# EAGLE design lab1-schematic (EAGLE 9.5.2)
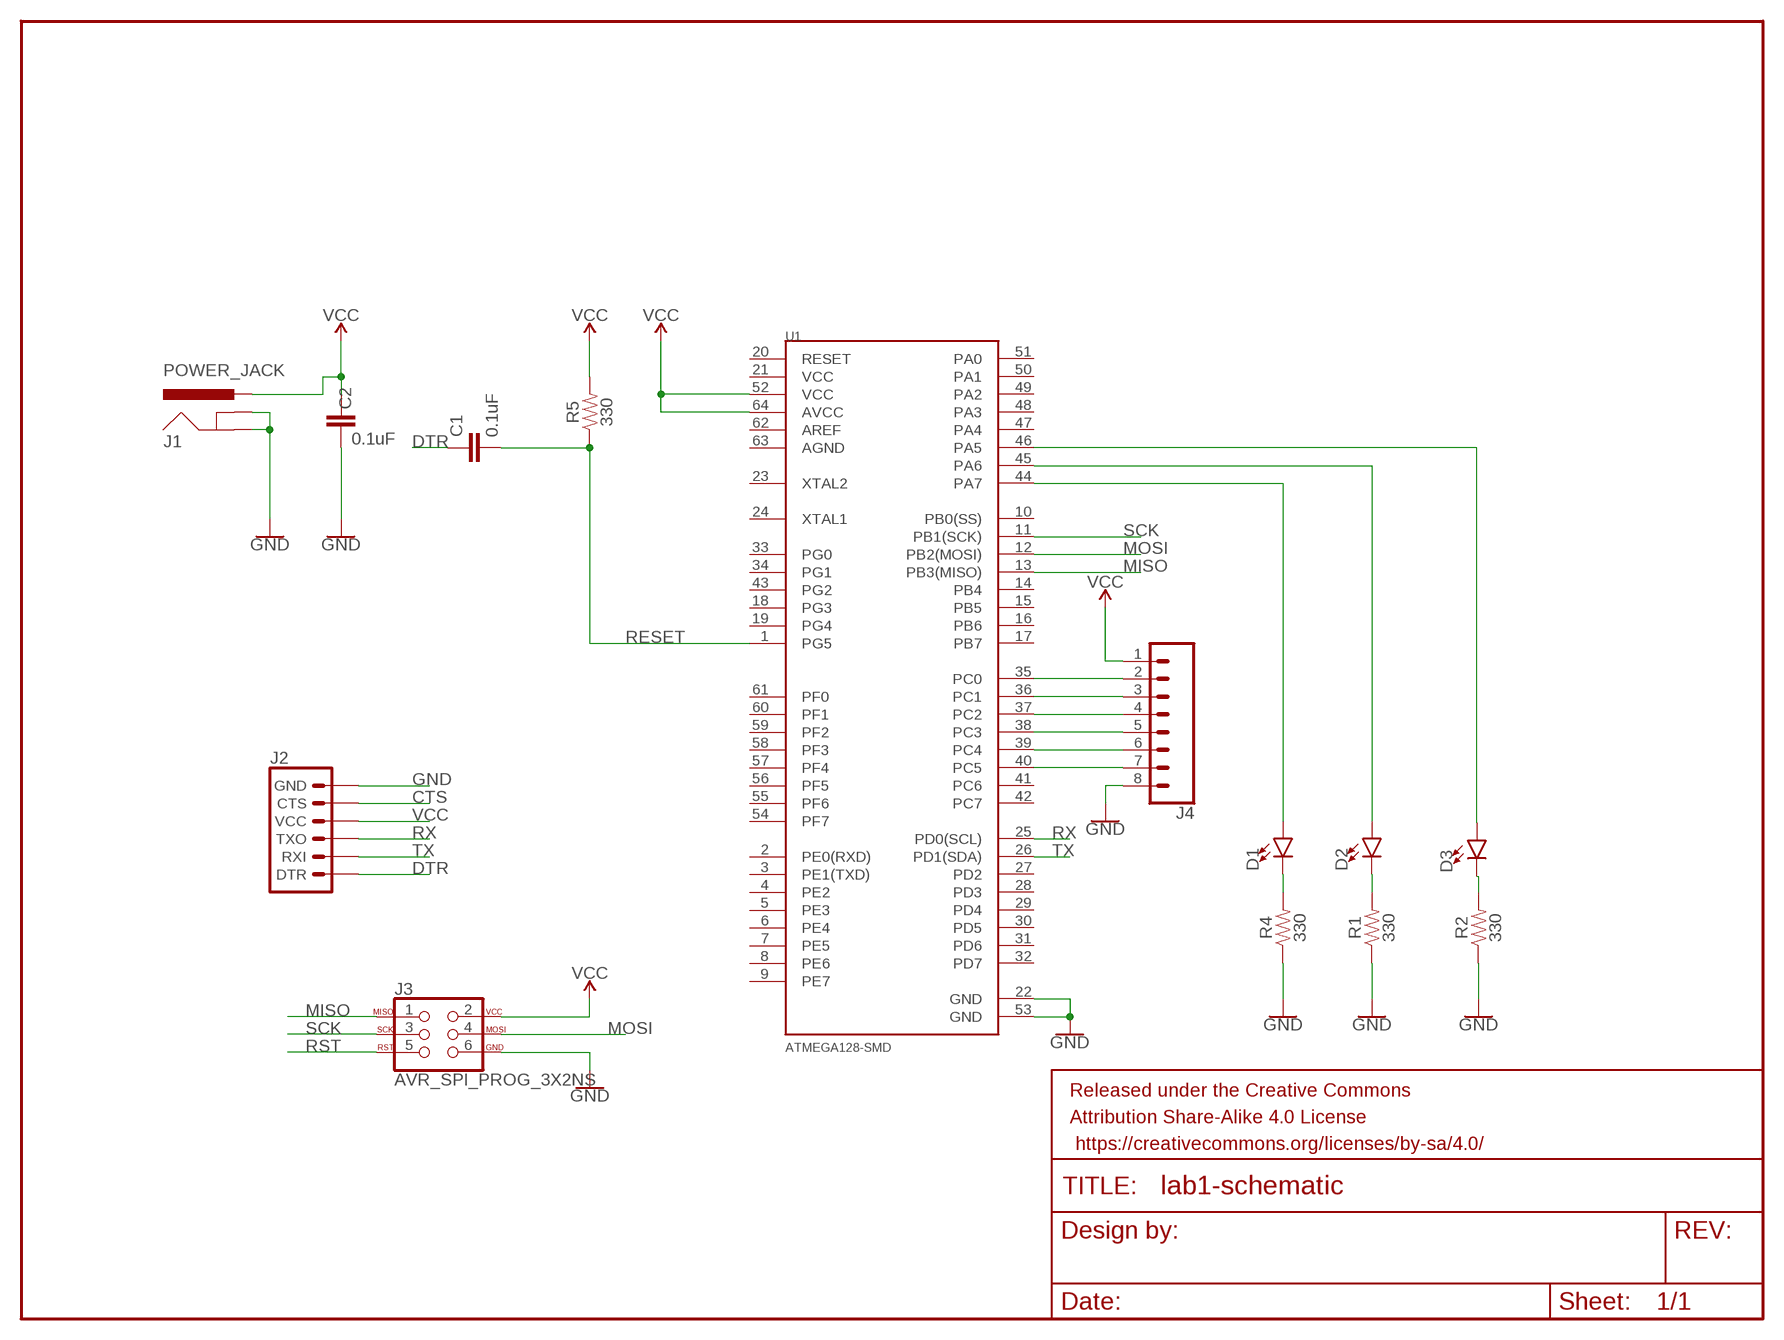
[diagram p0: schematic, sheet 1]

## Parts
C1  0.1uF  0.1UF-KIT-EZ-50V-20%  [CAP-PTH-SMALL-KIT]
C2  0.1uF  0.1UF-KIT-EZ-50V-20%  [CAP-PTH-SMALL-KIT]
D1  LED3MM  [LED_3MM]
D2  LED3MM  [LED_3MM]
D3  LED3MM  [LED_3MM]
FRAME1  FRAME-LETTER  [CREATIVE_COMMONS]
J1  POWER_JACK  [POWER_JACK_PTH]
J2  6_PIN_SERIAL_TARGET  [1X06]
J3  AVR_SPI_PROG_3X2NS  [2X3-NS]
J4  CONN_08"  [1X08]
R1  330  330OHM-HORIZ-1/10W-5%  [AXIAL-0.3]
R2  330  330OHM-HORIZ-1/10W-5%  [AXIAL-0.3]
R4  330  330OHM-HORIZ-1/10W-5%  [AXIAL-0.3]
R5  330  330OHM-HORIZ-1/10W-5%  [AXIAL-0.3]
U1  ATMEGA128-SMD  [TQFP64_14X14MM]

## Nets
CTS: J2.5(CTS)
DTR: C1.1 J2.1(DTR)
GND: C2.2 J1.GND J1.GNDBREAK J2.6(GND) J3.6 J4.8 R1.P$1 R2.P$1 R4.P$1 U1.22(GND) U1.53(GND)
MISO: J3.1 U1.13(PB3(MISO))
MOSI: J3.4 U1.12(PB2(MOSI))
N$2: J4.2 U1.35(PC0)
N$3: J4.3 U1.36(PC1)
N$4: J4.4 U1.37(PC2)
N$5: J4.5 U1.38(PC3)
N$6: J4.6 U1.39(PC4)
N$7: J4.7 U1.40(PC5)
N$8: D2.A U1.45(PA6)
N$9: D3.A U1.46(PA5)
N$10: D1.A U1.44(PA7)
N$11: D1.K(C) R4.P$2
N$12: D2.K(C) R1.P$2
N$13: D3.K(C) R2.P$2
RESET: C1.2 R5.P$1 U1.1(PG5)
RST: J3.5
RX: J2.3(TXO) U1.25(PD0(SCL))
SCK: J3.3 U1.11(PB1(SCK))
TX: J2.2(RXI) U1.26(PD1(SDA))
VCC: C2.1 J1.PWR J2.4(VCC) J3.2 J4.1 R5.P$2 U1.52(VCC) U1.64(AVCC)
Unconnected: U1.2(PE0(RXD)) U1.3(PE1(TXD)) U1.4(PE2) U1.5(PE3) U1.6(PE4) U1.7(PE5) U1.8(PE6) U1.9(PE7) U1.10(PB0(SS)) U1.14(PB4) U1.15(PB5) U1.16(PB6) U1.17(PB7) U1.18(PG3) U1.19(PG4) U1.20(RESET) U1.21(VCC) U1.23(XTAL2) U1.24(XTAL1) U1.27(PD2) U1.28(PD3) U1.29(PD4) U1.30(PD5) U1.31(PD6) U1.32(PD7) U1.33(PG0) U1.34(PG1) U1.41(PC6) U1.42(PC7) U1.43(PG2) U1.47(PA4) U1.48(PA3) U1.49(PA2) U1.50(PA1) U1.51(PA0) U1.54(PF7) U1.55(PF6) U1.56(PF5) U1.57(PF4) U1.58(PF3) U1.59(PF2) U1.60(PF1) U1.61(PF0) U1.62(AREF) U1.63(AGND)

## Library data of the parts
C1 C2 = SparkFun-Capacitors:0.1UF: 0.1µF ceramic capacitors A capacitor is a passive two-terminal electrical component used to store electrical energy temporarily in an electric field.; PROD_ID: CAP-08370
D1-D3 = SparkFun-LED:LED: LED (Generic) Standard schematic elements and footprints for 5mm, 3mm, 1206, and 0603 sized LEDs. Generic LEDs with no color specified.; PROD_ID: DIO-08794
FRAME1 = SparkFun-Aesthetics:FRAME-LETTER: Schematic Frame - Letter Standard 8.5x11 US Letter frame
J1 = SparkFun-Connectors:POWER_JACK: Power Jack Connector This is the standard 5.5mm barrel jack for power. The PTH is the most common, proven, reliable, footprint. The Slot footprint only works if the mill layer is transmitted to the PCB fab house so be warned. Here are the connectors we sell at SparkFun: DC Barrel Power Jack/Connector <https://www.sparkfun.com/products/119> (PRT-00119) DC Barrel Power Jack/Connector (SMD) <https://www.sparkfun.com/products/12748> (PRT-12748) DC Barrel Jack Adapter - Breadboard Compatible <https://www.sparkfun.com/products/10811> (PRT-10811) It is used on this SparkFun product (and many, many others): SparkFun RedBoard - Programmed with Arduino <https://www.sparkfun.com/products/12757> (DEV-12757) Also, if you need a mating power supply or connector, please check these out: Wall Adapter Power Supply - 9VDC 650mA <https://www.sparkfun.com/products/298> (TOL-00298) DC Barrel Jack Adapter - Male <https://www.sparkfun.com/products/10287> (PRT-10287); PROD_ID: CONN-08197
J2 = SparkFun-Connectors:6_PIN_SERIAL_TARGET: 6-pin header connection for use with the "FTDI BASIC" pinout - TARGET SIDE. Also known as "Arduino Serial Program Header". It is used to mate with our FTDI Basic serial programmers using the Arduino IDE. Note, this device has "TARGET" in the name. It is intended to be used on a design that contains a target micro-controller that you wish to program. The "sister" device, named "CABLE" is inteneded to be used on a design that usually lives on the end of your USB cable and prvides the converter chip (FTDI232 or FTDI231x) to commnicate serial RX/TX. You can populate with some of these: Break Away Headers - Straight <https://www.sparkfun.com/products/116> (PRT-00116) For reference (or to suit your programming needs) check out these designs: SparkFun FTDI Basic Breakout - 5V <https://www.sparkfun.com/products/9716> (DEV-09716) SparkFun FTDI Basic Breakout - 3.3V <https://www.sparkfun.com/products/9873> (DEV-09873) SparkFun FTDI SmartBasic <https://www.sparkfun.com/products/12935> (DEV-12935) SparkFun Beefy 3 - FTDI Basic Breakout <https://www.sparkfun.com/products/13746> (DEV-13746)
J3 = SparkFun-Connectors:AVR_SPI_PROG_3X2: AVR ISP 6 Pin This is the reduced ISP connector for AVR programming. Common on Arduino. This footprint will take up less PCB space and can be used with a 10-pin to 6-pin adapter such as SKU: BOB-08508 **Special note about "TEST_POINT" package. The stop mask is on the top side, so if you want your programming test points to be on the bottom of your board, make sure to place this package on the bottom side of the board. This also ensure that the orientation to program from the bottom side will be correct. SparkFun Products: SparkFun ISP Pogo Adapter <https://www.sparkfun.com/products/11591> - NS Tiny AVR Programmer <https://www.sparkfun.com/products/11801> -PTH
J4 = SparkFun-Connectors:CONN_08: Multi connection point. Often used as Generic Header-pin footprint for 0.1 inch spaced/style header connections On any of the 0.1 inch spaced packages, you can populate with these: Break Away Headers - Straight <https://www.sparkfun.com/products/116> (PRT-00116) Break Away Male Headers - Right Angle <https://www.sparkfun.com/products/553> (PRT-00553) Female Headers <https://www.sparkfun.com/products/115> (PRT-00115) Break Away Headers - Machine Pin <https://www.sparkfun.com/products/117> (PRT-00117) Break Away Female Headers - Swiss Machine Pin <https://www.sparkfun.com/products/743> (PRT-00743) Arduino Stackable Header - 8 Pin <https://www.sparkfun.com/products/9279> (PRT-09279) For SCREWTERMINALS and SPRING TERMINALS visit here: Screw Terimnals on SparkFun.com <https://www.sparkfun.com/search/results?term=Screw+Terminals> (5mm/3.5mm/2.54mm spacing) This device is also useful as a general connection point to wire up your design to another part of your project. Our various solder wires solder well into these plated through hole pads. Hook-Up Wire - Assortment (Stranded, 22 AWG) <https://www.sparkfun.com/products/11375> (PRT-11375) Hook-Up Wire - Assortment (Solid Core, 22 AWG) <https://www.sparkfun.com/products/11367> (PRT-11367) View the entire wire category on our website here <https://www.sparkfun.com/categories/141> Special notes: Molex polarized connector foot print use with SKU : PRT-08231 with associated crimp pins and housings. 1MM SMD Version SKU: PRT-10208 NOTES ON THE VARIANTS LOCK and LOCK_LONGPADS... This footprint was designed to help hold the alignment of a through-hole component (i.e. 6-pin header) while soldering it into place. You may notice that each hole has been shifted either up or down by 0.005 of an inch from it's more standard position (which is a perfectly straight line). This slight alteration caused the pins (the squares in the middle) to touch the edges of the holes. Because they are alternating, it causes a "brace" to hold the component in place. 0.005 has proven to be the perfect amount of "off-center" position when using our standard breakaway headers. Although looks a little odd when you look at the bare footprint, once you have a header in there, the alteration is very hard to notice. Also,if you push a header all the way into place, it is covered up entirely on the bottom side.; PROD_ID: CONN-08438
R1 R2 R4 R5 = SparkFun-Resistors:330OHM: 330Ω resistor A resistor is a passive two-terminal electrical component that implements electrical resistance as a circuit element. Resistors act to reduce current flow, and, at the same time, act to lower voltage levels within circuits. - Wikipedia; PROD_ID: RES-8371
U1 = SparkFun-IC-Microcontroller:ATMEGA128: ATmega 128 ATmega128/128L/1281/2561. Note: The ATmega128 pin 1 is PEN and the ATmega256/1281 pin 1 is PG5. Not in catalog

## Board
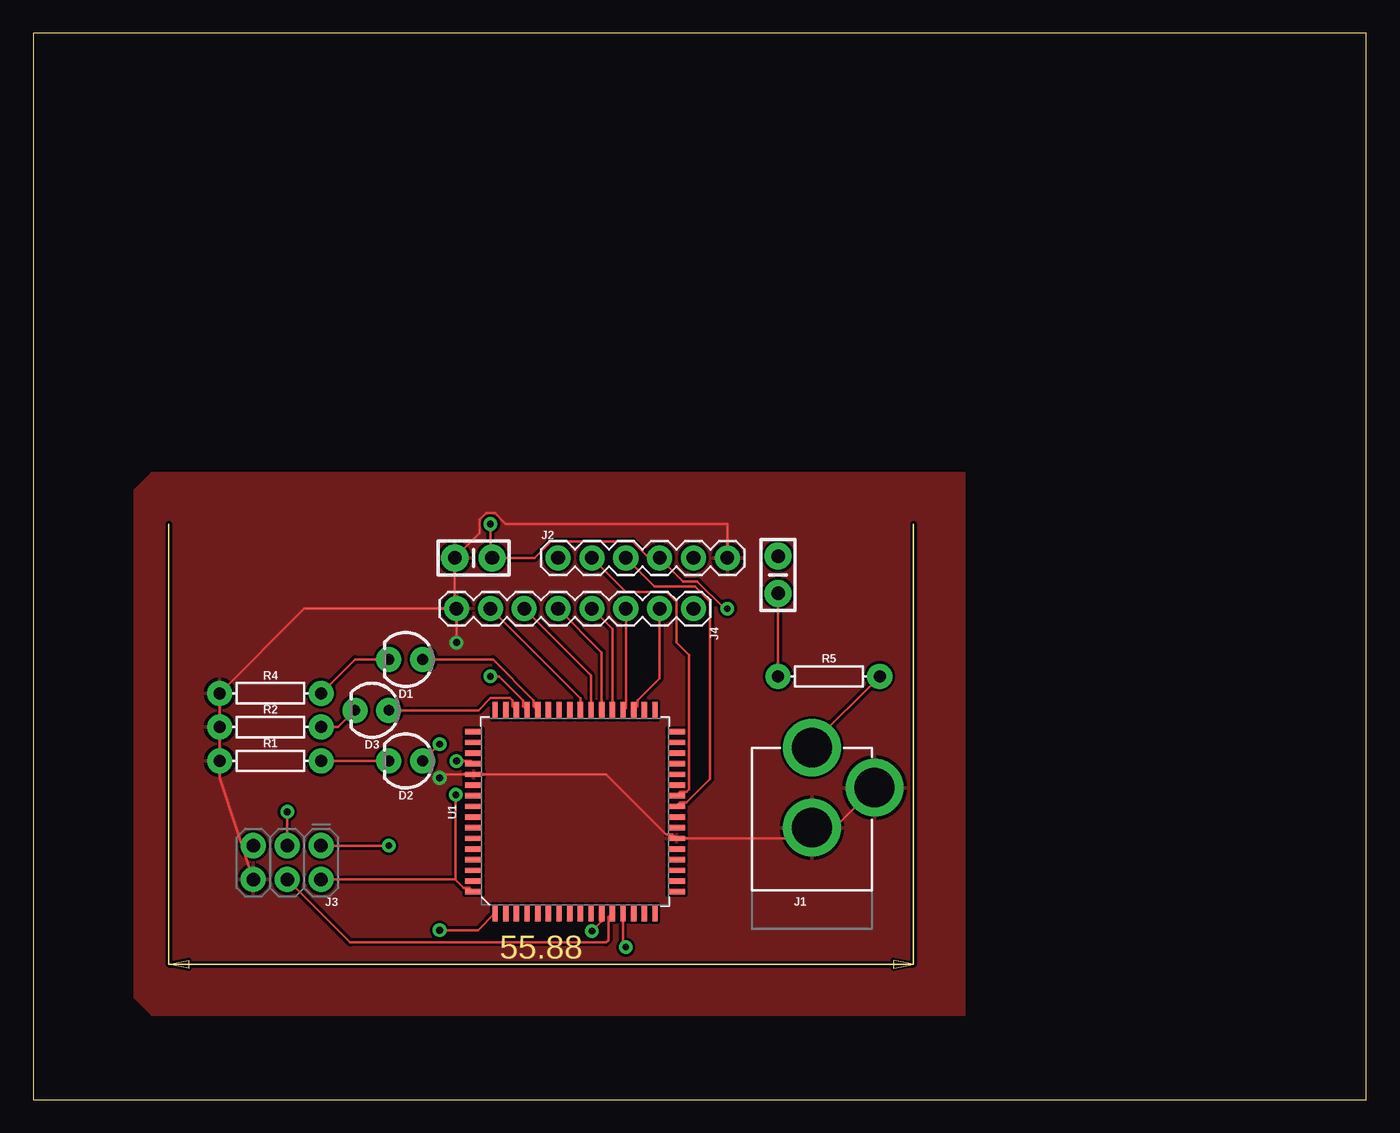
[diagram p1: board, top side]
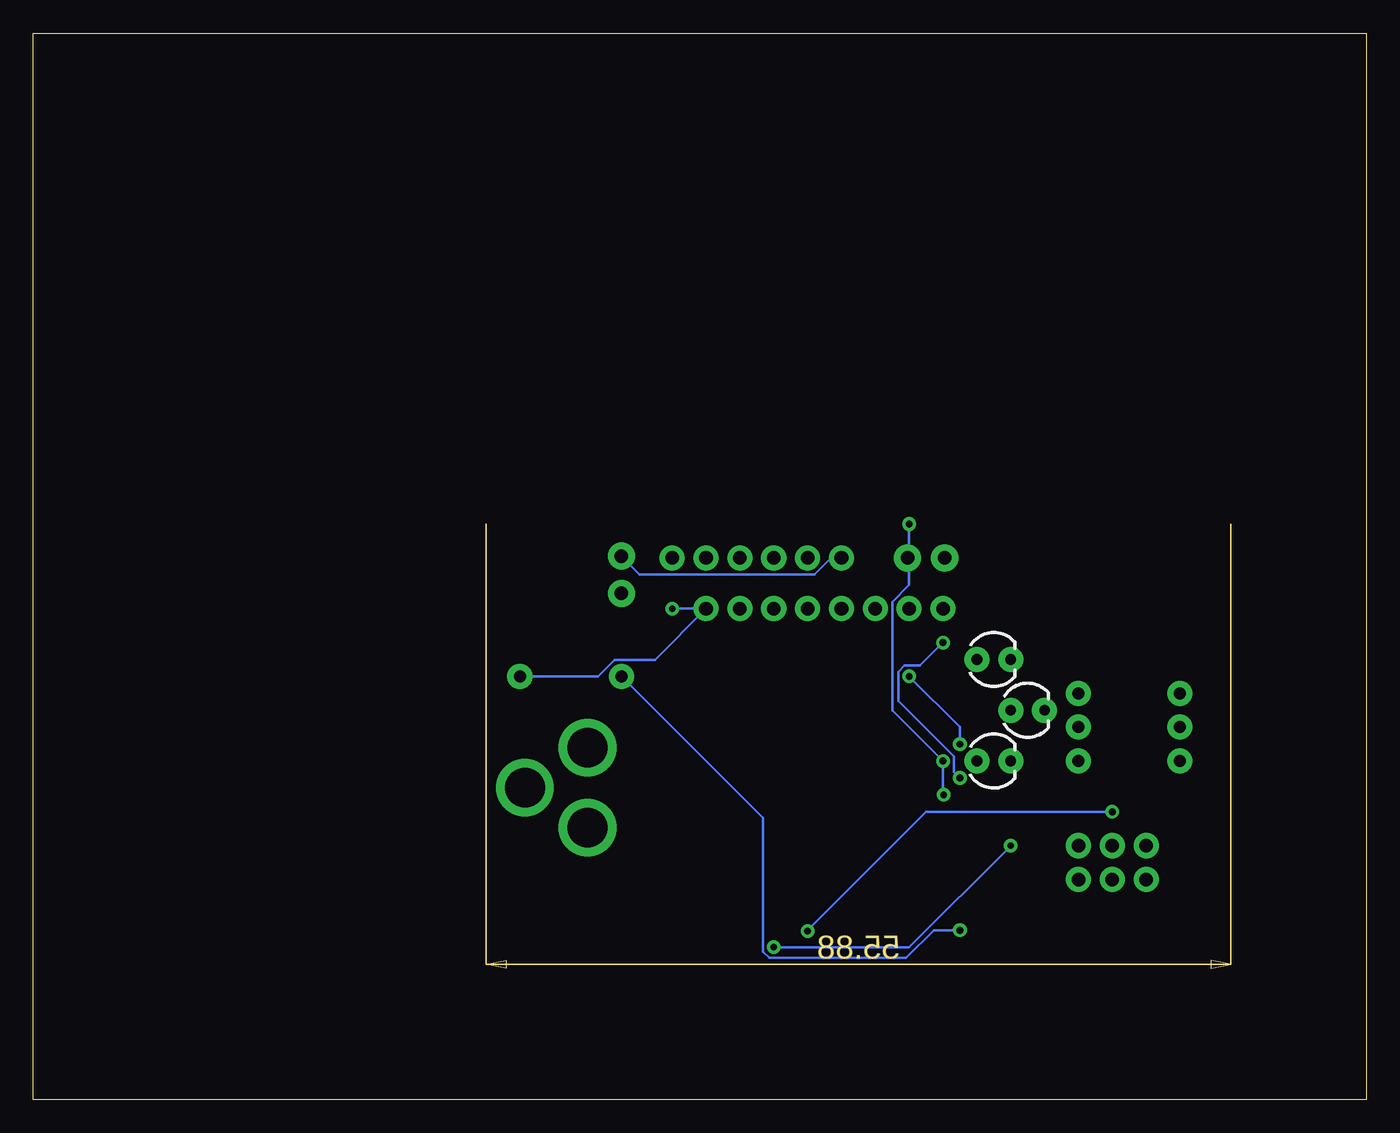
[diagram p2: board, bottom side, seen from below]

Size 100 x 80 mm. Coordinates in mm from the lower left corner, seen from the top.
Outline: 0,0 100,0 100,80 0,80 0,0
Copper layers (1*16): Top 0.035mm / dielectric 1.5mm / Bottom 0.035mm
Design rules "SparkFun": minimum track width 8mil, minimum drill 20mil, track to track 8mil, track to pad 8mil, pad to pad 8mil, via to via 8mil, smd to smd 8mil, copper to edge 8mil, drill to drill 8mil, minimum pad ring 12mil, minimum via ring 10mil, stop-mask expansion 4mil, vias tented up to drill 20mil, thermal gap 10mil

### Footprints (pad centres in the part's own frame; a part is rotated, then mirrored left to right if it is on the bottom)
CAP-PTH-SMALL-KIT = drill 1.016 pad 2.032: 1 -1.397,0; 2 1.397,0
LED_3MM = drill 0.813 pad 1.88: A -1.27,0; K 1.27,0
POWER_JACK_PTH = drill 2.997 pad 4.318: GND 0,7.7; GNDBREAK 4.7,10.7; PWR 0,13.7
1X06 = drill 1.016 pad 1.88: 1 0,0; 2 2.54,0; 3 5.08,0; 4 7.62,0; 5 10.16,0; 6 12.7,0
2X3-NS = drill 1.016 pad 1.88: 1 -2.54,-1.27; 2 -2.54,1.27; 3 0,-1.27; 4 0,1.27; 5 2.54,-1.27; 6 2.54,1.27
1X08 = drill 1.016 pad 1.88: 1 0,0; 2 2.54,0; 3 5.08,0; 4 7.62,0; 5 10.16,0; 6 12.7,0; 7 15.24,0; 8 17.78,0
AXIAL-0.3 = drill 0.9 pad 1.88: P$1 -3.81,0; P$2 3.81,0
TQFP64_14X14MM = smd 0.4 x 1.27: 1 -6,-7.6; 2 -5.2,-7.6; 3 -4.4,-7.6; 4 -3.6,-7.6; 5 -2.8,-7.6; 6 -2,-7.6; 7 -1.2,-7.6; 8 -0.4,-7.6; 9 0.4,-7.6; 10 1.2,-7.6; 11 2,-7.6; 12 2.8,-7.6; 13 3.6,-7.6; 14 4.4,-7.6; 15 5.2,-7.6; 16 6,-7.6; 33 6,7.6; 34 5.2,7.6; 35 4.4,7.6; 36 3.6,7.6; 37 2.8,7.6; 38 2,7.6; 39 1.2,7.6; 40 0.4,7.6; 41 -0.4,7.6; 42 -1.2,7.6; 43 -2,7.6; 44 -2.8,7.6; 45 -3.6,7.6; 46 -4.4,7.6; 47 -5.2,7.6; 48 -6,7.6 | smd 1.27 x 0.4: 17 7.6,-6; 18 7.6,-5.2; 19 7.6,-4.4; 20 7.6,-3.6; 21 7.6,-2.8; 22 7.6,-2; 23 7.6,-1.2; 24 7.6,-0.4; 25 7.6,0.4; 26 7.6,1.2; 27 7.6,2; 28 7.6,2.8; 29 7.6,3.6; 30 7.6,4.4; 31 7.6,5.2; 32 7.6,6; 49 -7.6,6; 50 -7.6,5.2; 51 -7.6,4.4; 52 -7.6,3.6; 53 -7.6,2.8; 54 -7.6,2; 55 -7.6,1.2; 56 -7.6,0.4; 57 -7.6,-0.4; 58 -7.6,-1.2; 59 -7.6,-2; 60 -7.6,-2.8; 61 -7.6,-3.6; 62 -7.6,-4.4; 63 -7.6,-5.2; 64 -7.6,-6

### Placement (x,y rotation side)
C1  55.88,39.37 270 top
C2  33.02,40.64 180 top
D1  27.94,33.02 180 top
D2  27.94,25.4 180 top
D3  25.4,29.21 180 top
FRAME1  -80.01,19.05 0 top  (outside the outline)
J1  58.42,12.7 0 top
J2  39.37,40.64 0 top
J3  19.05,17.78 180 top
J4  49.53,36.83 180 top
R1  17.78,25.4 0 top
R2  17.78,27.94 0 top
R4  17.78,30.48 0 top
R5  59.69,31.75 0 top
U1  40.64,21.59 0 top

### Tracks (layer width: path | path; a pad name or v marks a point on that pad's centre or on a via)
DTR
  Bottom 0.203: J2.1 40.15,40.64 41.39,39.4 54.51,39.4 C1.1
GND  (via drill 0.51)
  Top 0.203: J3.6 13.97,24.13 R1.P$1 R2.P$1 R4.P$1 20.32,36.83 J4.8 | J4.8 31.62,36.96 C2.2 33.48,42.49 33.48,43.52 33.95,43.99 34.63,43.99 35.44,43.18 52.07,43.18 J2.6 | U1.22 48.26,19.59 | 48.26,19.59 57.61,19.59 J1.GND 60.12,20.4 J1.GNDBREAK | J4.8 v31.75,34.29 | v30.48,24.13 30.74,24.39 U1.53 42.97,24.39 47.48,19.89 47.97,19.89 48.26,19.59
  Bottom 0.203: v30.48,24.13 30.94,24.59 30.94,25.74 35.1,29.9 35.1,32.09 34.63,32.56 33.48,32.56 v31.75,34.29
  pour Top (isolate 0): 8.89,46.99 69.85,46.99 69.85,6.35 8.89,6.35 7.62,7.62 7.62,45.72
MISO  (via drill 0.51)
  Top 0.203: J3.1 v26.67,19.05 | v44.45,11.43 44.24,11.64 U1.13
  Bottom 0.203: v26.67,19.05 34.29,11.43 v44.45,11.43
MOSI
  Top 0.203: U1.12 43.15,13.7 43.15,11.96 42.97,11.78 23.78,11.78 J3.4
N$2
  Top 0.203: U1.35 45.34,29.48 45.34,29.95 46.99,31.61 J4.2
N$3
  Top 0.203: J4.3 44.45,29.4 U1.36
N$4
  Top 0.203: J4.4 43.44,35.3 U1.37
N$5
  Top 0.203: J4.5 42.64,33.56 U1.38
N$6
  Top 0.203: J4.6 41.84,31.82 U1.39
N$7
  Top 0.203: J4.7 41.04,30.08 U1.40
N$8  (via drill 0.51)
  Top 0.203: D2.A v30.48,26.67 | U1.45 36.74,29.48 36.74,29.95 34.95,31.75 v34.29,31.75
  Bottom 0.203: v30.48,26.67 30.48,27.94 v34.29,31.75
N$9
  Top 0.203: D3.A 33.39,29.21 34.31,30.13 35.77,30.13 35.95,29.95 35.95,29.48 U1.46
N$10
  Top 0.203: U1.44 37.55,29.48 37.55,29.95 34.48,33.02 D1.A
N$11
  Top 0.203: R4.P$2 24.13,33.02 D1.K
N$12
  Top 0.203: R1.P$2 D2.K
N$13
  Top 0.203: R2.P$2 22.86,27.94 D3.K
RESET  (via drill 0.51)
  Top 0.203: U1.1 33.35,12.7 v30.48,12.7 | C1.2 R5.P$1
  Bottom 0.203: v30.48,12.7 32.45,12.7 34.53,10.62 44.79,10.62 45.26,11.09 45.26,21.13 R5.P$1
RX
  Top 0.203: J2.3 46.61,38.48 49.64,38.48 50.77,37.35 50.77,24.06 49,22.29 48.53,22.29 U1.25
SCK  (via drill 0.51)
  Top 0.203: J3.3 v19.05,21.59 | v41.91,12.64 42.64,13.37 U1.11
  Bottom 0.203: v19.05,21.59 33.02,21.59 41.91,12.7 v41.91,12.64
TX
  Top 0.203: J2.2 44.48,38.08 47.51,38.08 48.24,37.34 48.24,34.31 49.18,33.37 49.18,23.26 49,23.09 48.53,23.09 U1.26
VCC  (via drill 0.51)
  Top 0.203: U1.64 32.74,15.88 32.28,15.88 31.65,16.51 | J3.2 31.65,16.51 | v34.29,43.18 34.29,40.77 C2.1 37.61,40.64 38.85,41.88 44.97,41.88 46.21,40.64 J2.4 48.74,38.89 49.81,38.89 51.87,36.83 v52.07,36.83 | v31.75,25.4 32.83,25.4 U1.52 | v31.69,22.86 31.69,16.55 31.65,16.51 | R5.P$2 58.42,26.67 J1.PWR
  Bottom 0.203: v34.29,43.18 34.29,38.59 35.53,37.35 35.53,29.18 v31.75,25.4 31.75,22.86 v31.69,22.86 | v52.07,36.83 J4.1 53.37,32.99 56.4,32.99 57.64,31.75 R5.P$2
  other vias: 46.99,40.64